# Altium project Electronics_PCB.PrjPcb
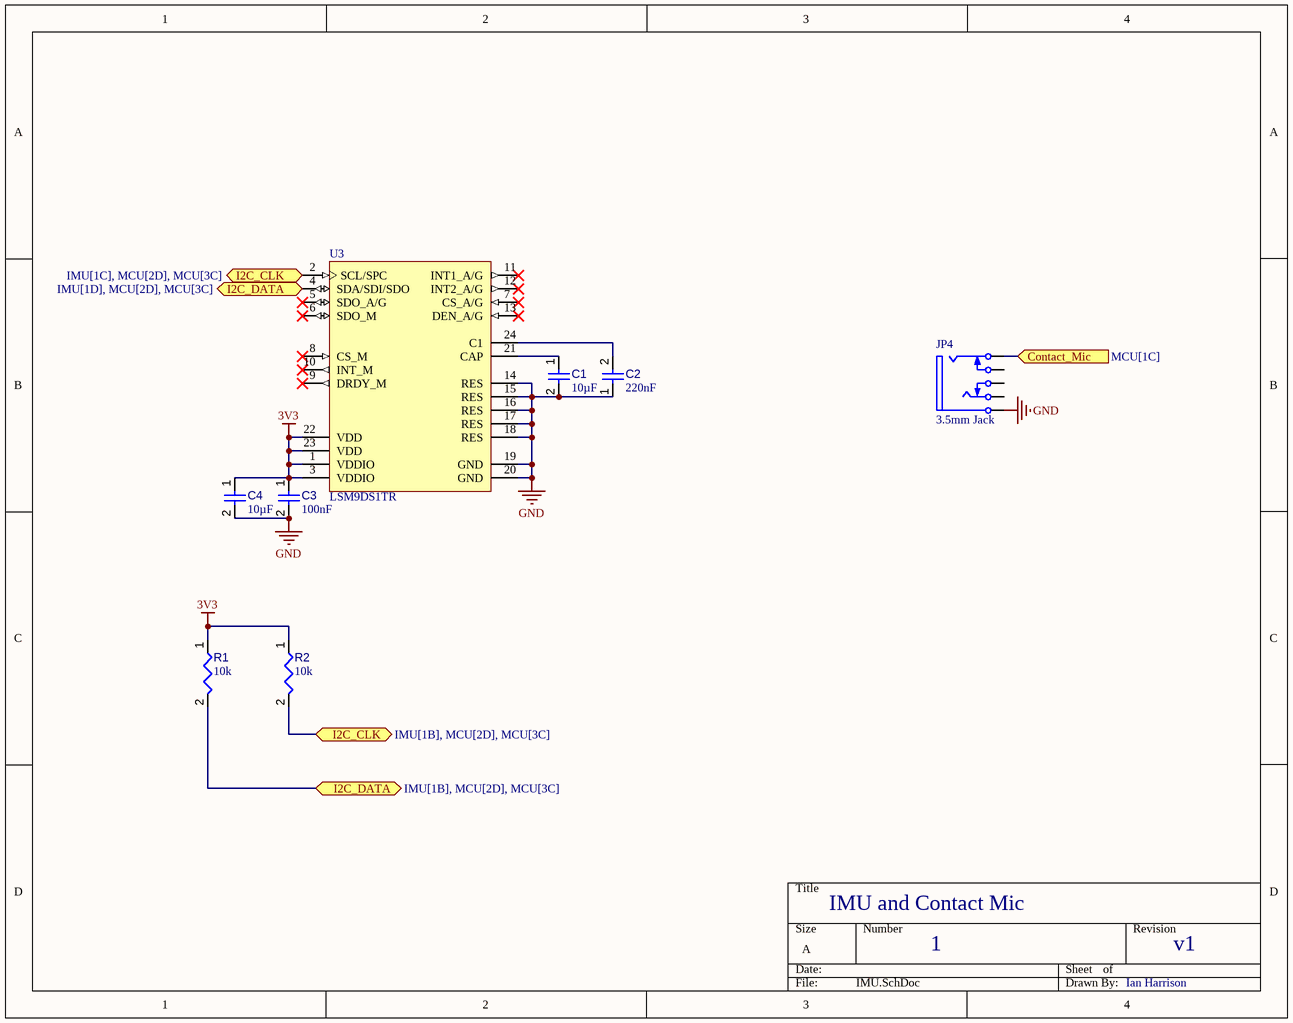
[diagram p0: IMU.SchDoc]
3 sheets, 39 parts. Net scope: flat (ports and power ports of the same name join across sheets).
Board files: PCB1.PcbDoc, PCB2.PcbDoc, PCB3.PcbDoc
Sheets:
  IMU.SchDoc
  MCU.SchDoc
  ECG.SchDoc

## Sheet IMU.SchDoc
size A; SheetNumber: 1; SheetTotal: 3

### Parts
C1  value 10µF  [CAPC0603(1608)100_L]  (hidden comment: Capacitor 10µF +/-20% 10V 0603)
C2  value 220nF  [FP-C0603C-CF-IPC_B]  (hidden comment: Capacitor 220 nF)
C3  value 100nF  [CAPC1608X90X40NL10T20]  (hidden comment: Capacitor 100 nF +/-10% 50 V 0603)
C4  value 10µF  [CAPC0603(1608)100_L]  (hidden comment: Capacitor 10µF +/-20% 10V 0603)
JP4  3.5mm Jack  [SWIT-35RASMT4BHNTRX_V]
R1  value 10k  [RESC1608X55X25ML10T15]  (hidden comment: Resistor 10k +/-1% 0603 100 mW)
R2  value 10k  [RESC1608X55X25ML10T15]  (hidden comment: Resistor 10k +/-1% 0603 100 mW)
U3  LSM9DS1TR  [STM-LGA-24_3500X3000X1000]

### Ports
Contact_Mic (in, see MCU[1C]), I2C_CLK (bidir, see IMU[1B], MCU[2D], MCU[3C]), I2C_CLK (bidir, see IMU[1C], MCU[2D], MCU[3C]), I2C_DATA (bidir, see IMU[1B], MCU[2D], MCU[3C]), I2C_DATA (bidir, see IMU[1D], MCU[2D], MCU[3C])

### Nets
3V3: C3.1 C4.1 R1.1 R2.1 U3.1(VDDIO) U3.3(VDDIO) U3.22(VDD) U3.23(VDD)
GND: C1.2 C2.1 C3.2 C4.2 JP4.1 U3.14(RES) U3.15(RES) U3.16(RES) U3.17(RES) U3.18(RES) U3.19(GND) U3.20(GND)
NetC1_1: C1.1 U3.21(CAP)
NetC2_2: C2.2 U3.24(C1)
NetJP2_6: JP4.2 ; port Contact_Mic
NetJP3_11: R2.2 U3.2(SCL/SPC) ; port I2C_CLK
NetJP3_12: R1.2 U3.4(SDA/SDI/SDO) ; port I2C_DATA

Not connected (* = marked no-connect by the designer): JP4 3 4 5; U3 5(SDO_A/G)* 6(SDO_M)* 7(CS_A/G)* 8(CS_M)* 9(DRDY_M)* 10(INT_M)* 11(INT1_A/G)* 12(INT2_A/G)* 13(DEN_A/G)*

### Notes on the sheet
- IMU and Contact Mic
- 1
- v1
- Ian Harrison

### Library data of the parts
C1 C4 = CMP-001-00075-4: Chip Capacitor, 10µF +/-20%, 10V, 0603, Thickness 1 mm; Tolerance: 10%; Voltage Rating: 10V; Max Operating Temperature: 85°C; Pins: 2; Case/Package: 0603; Mounting Technology: SMT; Min Operating Temperature: -55°C
C2 = CMP-001-00085-2: Ceramic Capacitor, Multilayer, Ceramic, 25V, 10% +Tol, 10% -Tol, X7R, 15% TC, 0.22uF, Surface Mount, 0603; Capacitor Type: Ceramic; Min Operating Temperature: -55°C; RoHS Compliant: Yes; Case/Package: 0603; Mounting Technology: Surface Mount; Max Operating Temperature: 125°C; Pins: 2
C3 = CMP-001-00017-7: Chip Capacitor, 100 nF, +/- 10%, 50 V, 0603 (1608 Metric); Voltage Rating: 50V; Capacitor Type: Ceramic; Tolerance: 10%; Mounting Technology: SM; Max Operating Temperature: 125°C; RoHS Compliant: True; Pins: 2; Case/Package: 0603; Min Operating Temperature: -55°C
JP4 = CMP-002-00071-1: 3 Pole(s), Surface Mount Terminal, Jack; Connector Type: AUDIO/RCA CONNECTOR; Mounting Technology: Board; RoHS Compliant: Yes
R1 R2 = CMP-009-00017-5: Chip Resistor, 10 KOhm, +/- 1%, 01 W, -55 to 155 degC, 0603 (1608 Metric); Voltage Rating: 50V; Power: 100mW; RoHS Compliant: True; Min Operating Temperature: -55°C; Pins: 2; Case/Package: 0603; Mounting Technology: SM; Max Operating Temperature: 155°C; Tolerance: 1%
U3 = CMP-2000-06606-1: iNEMO Inertial Module: 3D Accelerometer, 3D Gyroscope, 3D Magnetometer, 1.9 to 3.6 V, -40 to 85 degC, 24-Pin LGA, RoHS, Tape and Reel; Manufacturer: STMicroelectronics; SVHC: NoSVHC(17-Dec-2015); MEMS Module Function: Tri-AxisGyroscope,Tri-AxisAccelerometer,Tri-AxisMagnetometer; Supply Voltage Max: 3.6V; No. of Pins: 24Pins; Gyroscope Range: ±245°/s,±500°/s,±2000°/s; Acceleration Range: ±2g,±4g,±8g,±16g; Supply Voltage Min: 1.9V; Package Description: 24-Pin Plastic Land Grid Array Package, Body 3.65 x 3.15 mm, Pitch 0.43 mm; Manufacturer URL: http://www.st.com/; PartNumber: LSM9DS1; Product Range: -; Packaging: CutTape; Sensor Case Style: LGA; Datasheet URL: http://www2.st.com/content/ccc/resource/technical/document/datasheet/1e/3f/2a/d6/25/eb/48/46/DM00103319.pdf/files/DM00103319.pdf/jcr:content/translations/en.DM00103319.pdf; Package Reference: LGA-24_3500X3000X1000; Mounting Technology: SurfaceMount; Datasheet Version: Rev. 3, 03/2015; MSL: MSL3-168hours

## Sheet MCU.SchDoc
size A; SheetNumber: 2; SheetTotal: 3
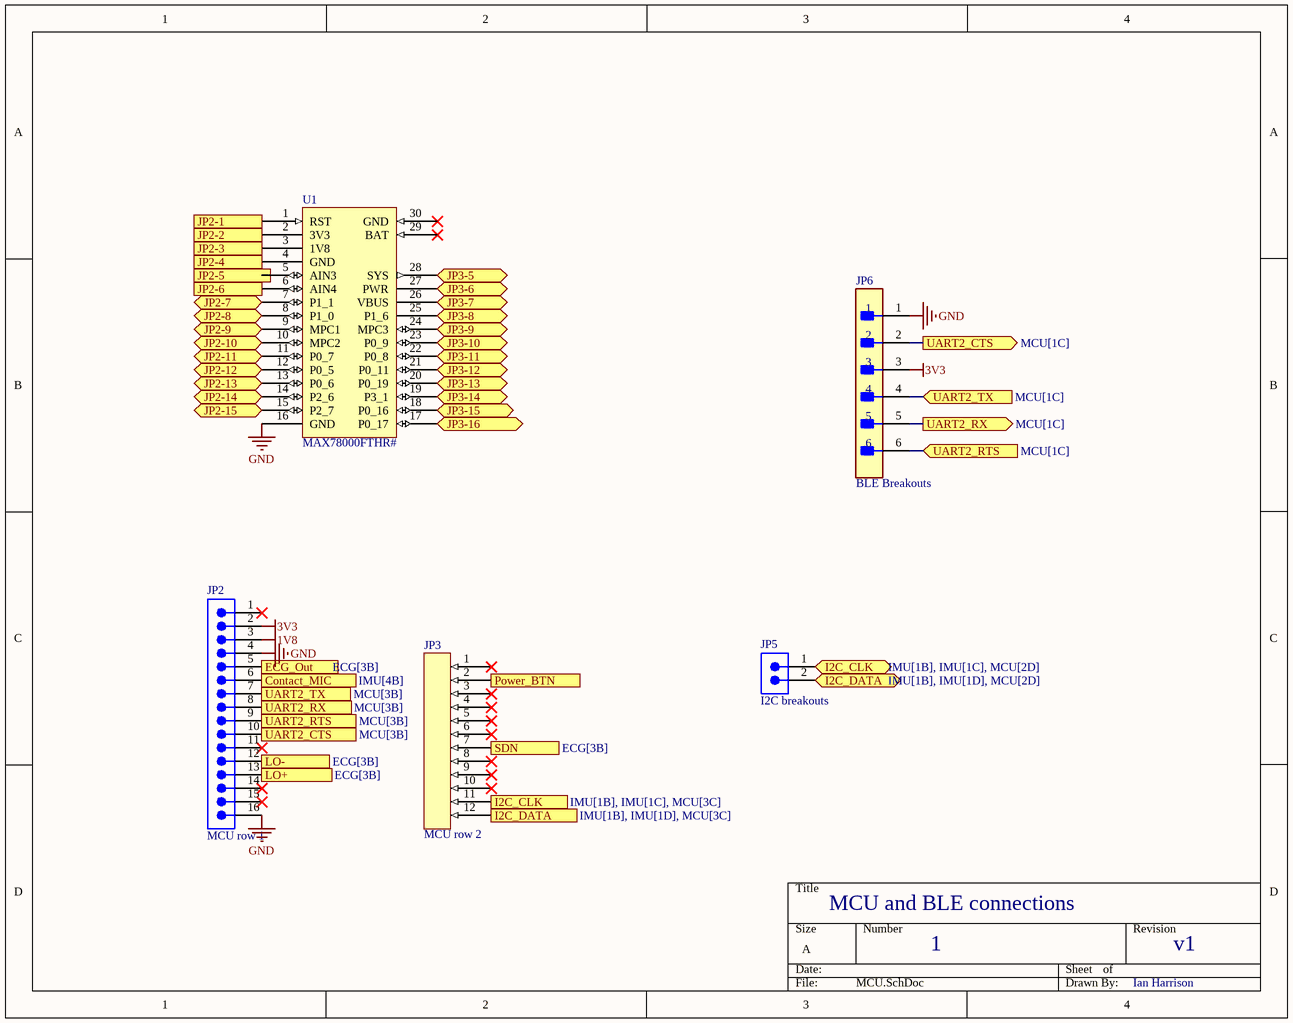
[diagram p1: MCU.SchDoc]

### Parts
JP2  MCU row 1  [SMTC-TSW-116-08-X-S]
JP3  MCU row 2  [New footprint 1]
JP5  I2C breakouts  [61300211121]
JP6  BLE Breakouts  [FP-22-28-4060-MFG]
U1  MAX78000FTHR#  (graphical)

### Ports
Contact_MIC (in, see IMU[4B]), ECG_Out (in, see ECG[3B]), I2C_CLK (bidir, see IMU[1B], IMU[1C], MCU[2D]), I2C_CLK (in, see IMU[1B], IMU[1C], MCU[3C]), I2C_DATA (bidir, see IMU[1B], IMU[1D], MCU[2D]), I2C_DATA (in, see IMU[1B], IMU[1D], MCU[3C]), JP2-1 (in), JP2-2, JP2-3, JP2-4, JP2-5 (in), JP2-6 (in), JP2-7 (bidir), JP2-8 (bidir), JP2-9 (bidir), JP2-10 (bidir), JP2-11 (bidir), JP2-12 (bidir), JP2-13 (bidir), JP2-14 (bidir), JP2-15 (bidir), JP3-5 (bidir), JP3-6 (bidir), JP3-7 (bidir), JP3-8 (bidir), JP3-9 (bidir), JP3-10 (bidir), JP3-11 (bidir), JP3-12 (bidir), JP3-13 (bidir), JP3-14 (bidir), JP3-15 (bidir), JP3-16 (bidir), LO+ (in, see ECG[3B]), LO- (in, see ECG[3B]), Power_BTN (in), SDN (out, see ECG[3B]), UART2_CTS (in, see MCU[3B]), UART2_CTS (out, see MCU[1C]), UART2_RTS (in, see MCU[1C]), UART2_RTS (out, see MCU[3B]), UART2_RX (in, see MCU[3B]), UART2_RX (out, see MCU[1C]), UART2_TX (in, see MCU[1C]), UART2_TX (out, see MCU[3B])

### Nets
1V8: JP2.3
3V3: JP2.2 JP6.3
GND: JP2.4 JP2.16 JP6.1 U1.16(GND)
NetC10_2: JP2.5 ; port ECG_Out
NetJP2_6: JP2.6 ; port Contact_MIC
NetJP2_7: JP2.7 JP6.4 ; port UART2_TX
NetJP2_8: JP2.8 JP6.5 ; port UART2_RX
NetJP2_9: JP2.9 JP6.6 ; port UART2_RTS
NetJP2_10: JP2.10 JP6.2 ; port UART2_CTS
NetJP2_12: JP2.12 ; port LO-
NetJP2_13: JP2.13 ; port LO+
NetJP3_2: JP3.2 ; port Power_BTN
NetJP3_7: JP3.7 ; port SDN
NetJP3_11: JP3.11 JP5.1 ; port I2C_CLK
NetJP3_12: JP3.12 JP5.2 ; port I2C_DATA
NetU1_1: U1.1(RST) ; port JP2-1
NetU1_2: U1.2(3V3) ; port JP2-2
NetU1_3: U1.3(1V8) ; port JP2-3
NetU1_4: U1.4(GND) ; port JP2-4
NetU1_6: U1.6(AIN4) ; port JP2-6
NetU1_7: U1.7(P1_1) ; port JP2-7
NetU1_8: U1.8(P1_0) ; port JP2-8
NetU1_9: U1.9(MPC1) ; port JP2-9
NetU1_10: U1.10(MPC2) ; port JP2-10
NetU1_11: U1.11(P0_7) ; port JP2-11
NetU1_12: U1.12(P0_5) ; port JP2-12
NetU1_13: U1.13(P0_6) ; port JP2-13
NetU1_14: U1.14(P2_6) ; port JP2-14
NetU1_15: U1.15(P2_7) ; port JP2-15
NetU1_17: U1.17(P0_17) ; port JP3-16
NetU1_18: U1.18(P0_16) ; port JP3-15
NetU1_19: U1.19(P3_1) ; port JP3-14
NetU1_20: U1.20(P0_19) ; port JP3-13
NetU1_21: U1.21(P0_11) ; port JP3-12
NetU1_22: U1.22(P0_8) ; port JP3-11
NetU1_23: U1.23(P0_9) ; port JP3-10
NetU1_24: U1.24(MPC3) ; port JP3-9
NetU1_25: U1.25(P1_6) ; port JP3-8
NetU1_26: U1.26(VBUS) ; port JP3-7
NetU1_27: U1.27(PWR) ; port JP3-6
NetU1_28: U1.28(SYS) ; port JP3-5

Not connected (* = marked no-connect by the designer): JP2 1* 11* 14* 15*; JP3 1* 3* 4* 5* 6* 8* 9* 10*; U1 5(AIN3) 29(BAT)* 30(GND)*

### Notes on the sheet
- MCU and BLE connections
- 1
- v1
- Ian Harrison

### Library data of the parts
JP2 = CMP-002-00076-1: Board Connector, 16 Contact(s), 1 Row(s), Male, Straight, 0.1 inch Pitch, Solder Terminal, Black Insulator; RoHS Compliant: Yes; Connector Type: BOARD CONNECTOR; Mounting Technology: Board
JP3 = CMP-002-00080-1: 12 pin header male .1 pitch
JP5 = CMP-002-00074-2: Board Connector, 2 Contact(s), 1 Row(s), Male, Straight, 0.1 inch Pitch, Solder Terminal, Locking, Black Insulator, Plug; Mounting Technology: Board; Connector Type: BOARD CONNECTOR; Max Operating Temperature: 125°C; Min Operating Temperature: -40°C; RoHS Compliant: Yes
JP6 = CMP-002-00075-1: Board Connector, 6 Contact(s), 1 Row(s), Male, Straight, 0.1 inch Pitch, Solder Terminal, Locking, Black Insulator, Receptacle; RoHS Compliant: Yes; Connector Type: BOARD CONNECTOR; Mounting Technology: Board
U1 = CMP-020-00023-3: MAX78000 1000KBytes Flash Ultra-Low-Power Arm Cortex-M4 Processor Evaluation Board; Clock Frequency: 100MHz; RoHS Compliant: No

## Sheet ECG.SchDoc
size A; SheetNumber: 3; SheetTotal: 3
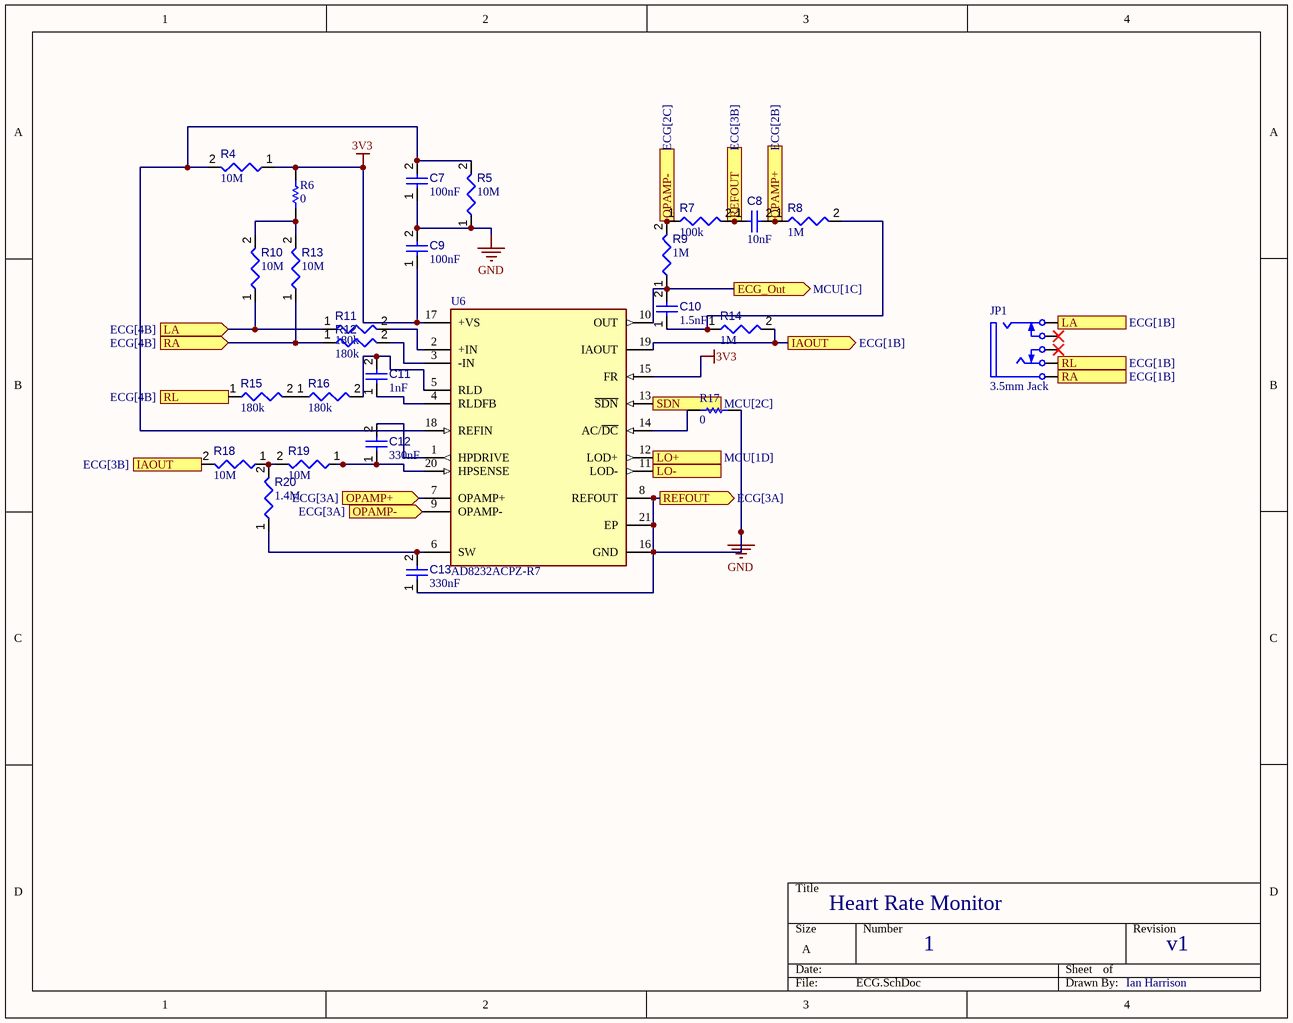
[diagram p2: ECG.SchDoc]

### Parts
C7  value 100nF  [CAPC1608X90X40NL10T20]  (hidden comment: Capacitor 100 nF +/-10% 50 V 0603)
C8  value 10nF  [FP-CC0603-DA-IPC_B]  (hidden comment: Capacitor 10nF 0603)
C9  value 100nF  [CAPC1608X90X40NL10T20]  (hidden comment: Capacitor 100 nF +/-10% 50 V 0603)
C10  value 1.5nF  [FP-GRM188-0_1-e0_2_0_5-IPC_B]  (hidden comment: Capacitor 1.5 nF 0603)
C11  value 1nF  [FP-0603-L_1_6_0_15-W_0_81-IPC_C]  (hidden comment: Capacitor 1 nF 0603)
C12  value 330nF  [FP-C1608-080-0_1-IPC_B]  (hidden comment: Capacitor .33 uF 0603)
C13  value 330nF  [FP-C1608-080-0_1-IPC_B]  (hidden comment: Capacitor .33 uF 0603)
JP1  3.5mm Jack  [SWIT-35RASMT4BHNTRX_V]
R4  value 10M  [RESC1608X55X30LL15T15]  (hidden comment: Resistor 10M)
R5  value 10M  [RESC1608X55X30LL15T15]  (hidden comment: Resistor 10M)
R6  value 0  [RESC1608X55X25ML10T15]  (hidden comment: Resistor 0R +/- 5% 0603 100 mW)
R7  value 100k  [RESC1608X55X25ML10T15]  (hidden comment: Resistor 100k +/-1% 0603 100 mW)
R8  value 1M  [FP-ERJ3EK-IPC_A]  (hidden comment: Resistor 1M 0603)
R9  value 1M  [FP-ERJ3EK-IPC_A]  (hidden comment: Resistor 1M 0603)
R10  value 10M  [RESC1608X55X30LL15T15]  (hidden comment: Resistor 10M)
R11  value 180k  [RESC1608X55X30LL15T15]  (hidden comment: Resistor 180k)
R12  value 180k  [RESC1608X55X30LL15T15]  (hidden comment: Resistor 180k)
R13  value 10M  [RESC1608X55X30LL15T15]  (hidden comment: Resistor 10M)
R14  value 1M  [FP-ERJ3EK-IPC_A]  (hidden comment: Resistor 1M 0603)
R15  value 180k  [RESC1608X55X30LL15T15]  (hidden comment: Resistor 180k)
R16  value 180k  [RESC1608X55X30LL15T15]  (hidden comment: Resistor 180k)
R17  value 0  [RESC1608X55X25ML10T15]  (hidden comment: Resistor 0R +/- 5% 0603 100 mW)
R18  value 10M  [RESC1608X55X30LL15T15]  (hidden comment: Resistor 10M)
R19  value 10M  [RESC1608X55X30LL15T15]  (hidden comment: Resistor 10M)
R20  value 1.4M  [RESC1609X50X30NL10T20]  (hidden comment: Resistor 1.4M 0603)
U6  AD8232ACPZ-R7  [FP-CP-20-8-IPC_B]

### Ports
ECG_Out (out, see MCU[1C]), IAOUT (in, see ECG[3B]), IAOUT (out, see ECG[1B]), LA (in, see ECG[4B]), LA (out, see ECG[1B]), LO+ (out, see MCU[1D]), LO- (out), OPAMP+ (in, see ECG[3A]), OPAMP+ (out, see ECG[2B]), OPAMP- (in, see ECG[3A]), OPAMP- (out, see ECG[2C]), RA (in, see ECG[4B]), RA (out, see ECG[1B]), REFOUT (in, see ECG[3B]), REFOUT (out, see ECG[3A]), RL (in, see ECG[4B]), RL (out, see ECG[1B]), SDN (in, see MCU[2C])

### Nets
3V3: C9.1 R4.1 R6.2 U6.15(FR) U6.17(+VS)
GND: C7.1 C8.1 C9.2 C13.1 R5.1 R7.2 R17.1 U6.8(REFOUT) U6.16(GND) U6.21(EP) ; port REFOUT
NetC7_2: C7.2 R4.2 R5.2 U6.18(REFIN)
NetC8_2: C8.2 R8.1 U6.7(OPAMP+) ; port OPAMP+
NetC10_1: C10.1 R8.2 R14.1
NetC10_2: C10.2 R9.1 U6.10(OUT) ; port ECG_Out
NetC11_1: C11.1 U6.4(RLDFB)
NetC11_2: C11.2 R16.2 U6.5(RLD)
NetC12_1: C12.1 R19.1 U6.20(HPSENSE)
NetC12_2: C12.2 U6.1(HPDRIVE)
NetC13_2: C13.2 R20.1 U6.6(SW)
NetJP1_1: JP1.1 R12.1 R13.1 ; port RA
NetJP1_2: JP1.2 R10.1 R11.1 ; port LA
NetJP1_3: JP1.3 R15.1 ; port RL
NetJP2_12: U6.11(LOD-) ; port LO-
NetJP2_13: U6.12(LOD+) ; port LO+
NetJP3_7: U6.13(~{SDN}) ; port SDN
NetR6_1: R6.1 R10.2 R13.2
NetR7_1: R7.1 R9.2 U6.9(OPAMP-) ; port OPAMP-
NetR11_2: R11.2 U6.2(+IN)
NetR12_2: R12.2 U6.3(-IN)
NetR14_2: R14.2 R18.2 U6.19(IAOUT) ; port IAOUT
NetR15_2: R15.2 R16.1
NetR17_2: R17.2 U6.14(AC/~{DC})
NetR18_1: R18.1 R19.2 R20.2

Not connected (* = marked no-connect by the designer): JP1 4* 5*

### Notes on the sheet
- Heart Rate Monitor
- 1
- v1
- Ian Harrison

### Library data of the parts
C7 C9 = CMP-001-00017-7: as C3 on sheet IMU; Tolerance: 10%; Mounting Technology: SM; Max Operating Temperature: 125°C; RoHS Compliant: True; Pins: 2; Case/Package: 0603; Min Operating Temperature: -55°C
C8 = CMP-001-00089-2: Ceramic Capacitor, Multilayer, Ceramic, 50V, 10% +Tol, 10% -Tol, X7R, 15% TC, 0.01uF, Surface Mount, 0603; Pins: 2; RoHS Compliant: Yes; Capacitor Type: Ceramic; Max Operating Temperature: 125°C; Min Operating Temperature: -55°C; Case/Package: 0603; Mounting Technology: Surface Mount
C10 = CMP-001-00088-2: Ceramic Capacitor, Multilayer, Ceramic, 50V, 5% +Tol, 5% -Tol, C0G, 30ppm/Cel TC, 0.0015uF, Surface Mount, 0603; RoHS Compliant: Yes; Max Operating Temperature: 125°C; Mounting Technology: Surface Mount; Pins: 2; Min Operating Temperature: -55°C; Capacitor Type: Ceramic; Case/Package: 0603
C11 = CMP-001-00087-2: Ceramic Capacitor, Multilayer, Ceramic, 50V, 10% +Tol, 10% -Tol, X7R, 15% TC, 0.001uF, Surface Mount, 0603; Mounting Technology: Surface Mount; Pins: 2; Capacitor Type: Ceramic; Min Operating Temperature: -55°C; Max Operating Temperature: 125°C; RoHS Compliant: Yes; Case/Package: 0603
C12 C13 = CMP-001-00086-2: Ceramic Capacitor, Multilayer, Ceramic, 50V, 10% +Tol, 10% -Tol, X7R, 15% TC, 0.33uF, Surface Mount, 0603; Mounting Technology: Surface Mount; Min Operating Temperature: -55°C; Max Operating Temperature: 125°C; Capacitor Type: Ceramic; Case/Package: 0603; Pins: 2; RoHS Compliant: Yes
JP1 = CMP-002-00071-1: as JP4 on sheet IMU; Mounting Technology: Board; RoHS Compliant: Yes
R4 R5 R10 R13 R18 R19 = CMP-009-00182-1: Fixed Resistor, Metal Glaze/thick Film, 0.1W, 10000000ohm, 75V, 5% +/-Tol, -400,150ppm/Cel, Surface Mount, 0603; Power: 100mW; Mounting Technology: Surface Mount; Pins: 2; Max Operating Temperature: 155°C; Case/Package: 0603; RoHS Compliant: Yes; Tolerance: 5%; Min Operating Temperature: -55°C
R6 R17 = CMP-009-00006-5: Chip Resistor, 0 Ohm, 0.1 W, -55 to 155 degC, 0603 (1608 Metric); Power: 100mW; Voltage Rating: 50V; Max Operating Temperature: 155°C; RoHS Compliant: True; Mounting Technology: SM; Case/Package: 0603; Min Operating Temperature: -55°C; Tolerance: 5%; Pins: 2
R7 = CMP-009-00023-5: Chip Resistor, 100 KOhm, +/- 1%, 0.1 W, -55 to 155 degC, 0603 (1608 Metric); Voltage Rating: 50V; Power: 100mW; Max Operating Temperature: 155°C; RoHS Compliant: True; Tolerance: 1%; Pins: 2; Case/Package: 0603; Mounting Technology: SM; Min Operating Temperature: -55°C
R8 R9 R14 = CMP-009-00185-2: Fixed Resistor, Metal Glaze/thick Film, 0.1W, 1000000ohm, 75V, 1% +/-Tol, 100ppm/Cel, Surface Mount, 0603; Power: 100mW; Pins: 2; Mounting Technology: Surface Mount; Case/Package: 0603; Min Operating Temperature: -55°C; Max Operating Temperature: 155°C; Tolerance: 1%; RoHS Compliant: Yes
R11 R12 R15 R16 = CMP-009-00177-1: Fixed Resistor, Metal Glaze/thick Film, 0.1W, 180000ohm, 75V, 1% +/-Tol, 100ppm/Cel, Surface Mount, 0603; Power: 100mW; RoHS Compliant: Yes; Mounting Technology: Surface Mount; Pins: 2; Case/Package: 0603; Tolerance: 1%; Max Operating Temperature: 155°C; Min Operating Temperature: -55°C
R20 = CMP-009-00184-1: Fixed Resistor, Metal Glaze/thick Film, 0.1W, 1400000ohm, 75V, 1% +/-Tol, 100ppm/Cel, Surface Mount, 0603; Power: 100mW; RoHS Compliant: Yes; Mounting Technology: Surface Mount; Max Operating Temperature: 155°C; Pins: 2; Case/Package: 0603; Min Operating Temperature: -55°C; Tolerance: 1%
U6 = CMP-010-00024-1: Analog Circuit, 1 Func, 1 Channel; Min Supply Voltage: 2V; Max Supply Voltage: 3.5V; Nominal Supply Voltage: 3V; Case/Package: HVQCCN; Min Operating Temperature: -40°C; Max Operating Temperature: 85°C; Pins: 20; RoHS Compliant: Yes

## Nets that join several sheets
3V3: IMU (8 pins), MCU (JP2.2 JP6.3), ECG (5 pins)
GND: IMU (12 pins), MCU (JP2.4 JP2.16 JP6.1 U1.16), ECG (10 pins)
NetC10_2: MCU (JP2.5), ECG (C10.2 R9.1 U6.10)
NetJP2_6: IMU (JP4.2), MCU (JP2.6)
NetJP2_12: MCU (JP2.12), ECG (U6.11)
NetJP2_13: MCU (JP2.13), ECG (U6.12)
NetJP3_7: MCU (JP3.7), ECG (U6.13)
NetJP3_11: IMU (R2.2 U3.2), MCU (JP3.11 JP5.1)
NetJP3_12: IMU (R1.2 U3.4), MCU (JP3.12 JP5.2)